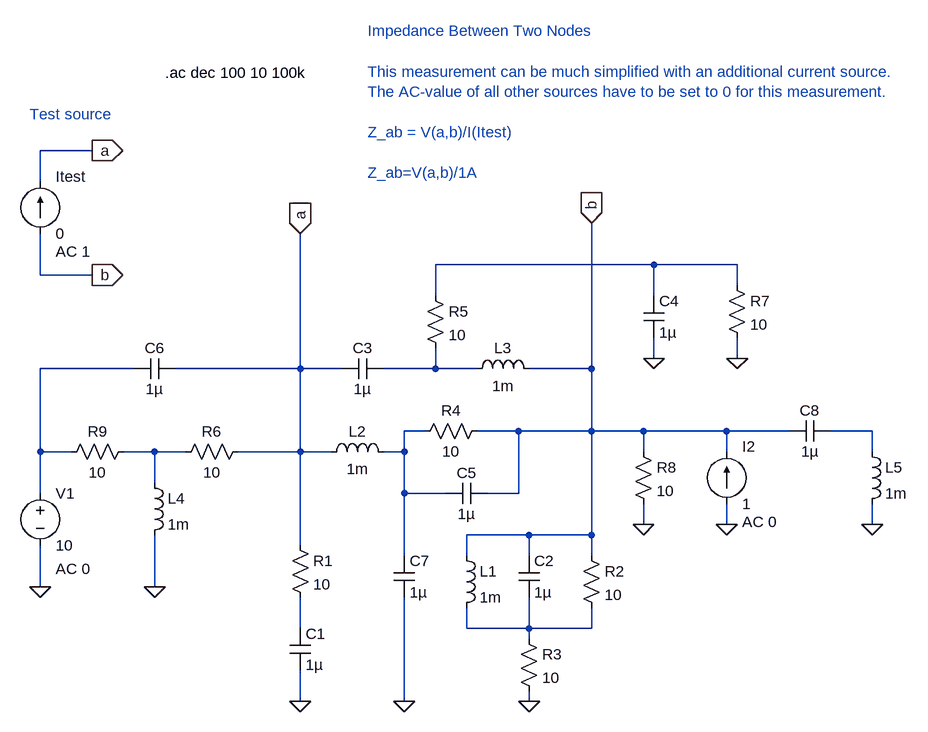
[diagram p0: schematic impedance_measurement1.asc]
impedance_measurement1.asc, the LTspice schematic file:
Version 4
SHEET 1 1068 680
WIRE -272 -384 -352 -384
WIRE -352 -336 -352 -384
WIRE 592 -208 256 -208
WIRE 720 -208 592 -208
WIRE -352 -192 -352 -256
WIRE -272 -192 -352 -192
WIRE 720 -176 720 -208
WIRE 256 -160 256 -208
WIRE 592 -160 592 -208
WIRE 592 -64 592 -96
WIRE 720 -64 720 -96
WIRE -208 -48 -352 -48
WIRE 48 -48 48 -256
WIRE 48 -48 -144 -48
WIRE 112 -48 48 -48
WIRE 256 -48 256 -80
WIRE 256 -48 176 -48
WIRE 320 -48 256 -48
WIRE 496 -48 496 -272
WIRE 496 -48 400 -48
WIRE 240 48 208 48
WIRE 384 48 320 48
WIRE 496 48 496 -48
WIRE 496 48 384 48
WIRE 576 48 496 48
WIRE 704 48 576 48
WIRE 800 48 704 48
WIRE 928 48 864 48
WIRE -352 80 -352 -48
WIRE -304 80 -352 80
WIRE -176 80 -224 80
WIRE -128 80 -176 80
WIRE 48 80 48 -48
WIRE 48 80 -48 80
WIRE 96 80 48 80
WIRE 208 80 208 48
WIRE 208 80 176 80
WIRE 576 80 576 48
WIRE 704 80 704 48
WIRE 928 80 928 48
WIRE -176 128 -176 80
WIRE -352 144 -352 80
WIRE 208 144 208 80
WIRE 272 144 208 144
WIRE 384 144 384 48
WIRE 384 144 336 144
WIRE 576 192 576 160
WIRE 704 192 704 160
WIRE 928 192 928 160
WIRE 400 208 304 208
WIRE 496 208 496 48
WIRE 496 208 400 208
WIRE 48 224 48 80
WIRE 208 240 208 144
WIRE 304 240 304 208
WIRE 400 240 400 208
WIRE 496 240 496 208
WIRE -352 288 -352 224
WIRE -176 288 -176 208
WIRE 48 352 48 304
WIRE 304 352 304 320
WIRE 400 352 400 304
WIRE 400 352 304 352
WIRE 496 352 496 320
WIRE 496 352 400 352
WIRE 400 368 400 352
WIRE 48 464 48 416
WIRE 208 464 208 304
WIRE 400 464 400 448
FLAG 592 -64 0
FLAG 720 -64 0
FLAG 400 464 0
FLAG 48 464 0
FLAG 576 192 0
FLAG -176 288 0
FLAG -352 288 0
FLAG 208 464 0
FLAG 928 192 0
FLAG 48 -256 a
IOPIN 48 -256 In
FLAG 496 -272 b
IOPIN 496 -272 In
FLAG -272 -384 a
IOPIN -272 -384 Out
FLAG -272 -192 b
IOPIN -272 -192 Out
FLAG 704 192 0
SYMBOL res 32 208 R0
SYMATTR InstName R1
SYMATTR Value 10
SYMBOL cap 32 352 R0
SYMATTR InstName C1
SYMATTR Value 1µ
SYMBOL ind 288 224 R0
SYMATTR InstName L1
SYMATTR Value 1m
SYMBOL cap 384 240 R0
SYMATTR InstName C2
SYMATTR Value 1µ
SYMBOL res 480 224 R0
SYMATTR InstName R2
SYMATTR Value 10
SYMBOL res 384 352 R0
SYMATTR InstName R3
SYMATTR Value 10
SYMBOL ind 80 96 R270
WINDOW 0 32 56 VTop 0
WINDOW 3 5 56 VBottom 0
SYMATTR InstName L2
SYMATTR Value 1m
SYMBOL res 224 64 R270
WINDOW 0 32 56 VTop 0
WINDOW 3 0 56 VBottom 0
SYMATTR InstName R4
SYMATTR Value 10
SYMBOL cap 112 -32 R270
WINDOW 0 32 32 VTop 0
WINDOW 3 0 32 VBottom 0
SYMATTR InstName C3
SYMATTR Value 1µ
SYMBOL res 240 -176 R0
SYMATTR InstName R5
SYMATTR Value 10
SYMBOL ind 304 -32 R270
WINDOW 0 32 56 VTop 0
WINDOW 3 5 56 VBottom 0
SYMATTR InstName L3
SYMATTR Value 1m
SYMBOL res -144 96 R270
WINDOW 0 32 56 VTop 0
WINDOW 3 0 56 VBottom 0
SYMATTR InstName R6
SYMATTR Value 10
SYMBOL cap 576 -160 R0
SYMATTR InstName C4
SYMATTR Value 1µ
SYMBOL res 704 -192 R0
SYMATTR InstName R7
SYMATTR Value 10
SYMBOL cap 272 160 R270
WINDOW 0 32 32 VTop 0
WINDOW 3 0 32 VBottom 0
SYMATTR InstName C5
SYMATTR Value 1µ
SYMBOL res 560 64 R0
SYMATTR InstName R8
SYMATTR Value 10
SYMBOL res -320 96 R270
WINDOW 0 32 56 VTop 0
WINDOW 3 0 56 VBottom 0
SYMATTR InstName R9
SYMATTR Value 10
SYMBOL ind -192 112 R0
SYMATTR InstName L4
SYMATTR Value 1m
SYMBOL voltage -352 128 R0
WINDOW 123 24 132 Left 0
WINDOW 39 0 0 Left 0
SYMATTR InstName V1
SYMATTR Value 10
SYMATTR Value2 AC 0
SYMBOL cap -208 -32 R270
WINDOW 0 32 32 VTop 0
WINDOW 3 0 32 VBottom 0
SYMATTR InstName C6
SYMATTR Value 1µ
SYMBOL cap 192 240 R0
SYMATTR InstName C7
SYMATTR Value 1µ
SYMBOL cap 800 64 R270
WINDOW 0 32 32 VTop 0
WINDOW 3 0 32 VBottom 0
SYMATTR InstName C8
SYMATTR Value 1µ
SYMBOL ind 912 64 R0
SYMATTR InstName L5
SYMATTR Value 1m
SYMBOL current 704 160 M180
WINDOW 0 24 88 Left 0
WINDOW 3 24 0 Left 0
WINDOW 123 24 -28 Left 0
WINDOW 39 0 0 Left 0
SYMATTR InstName I2
SYMATTR Value 1
SYMATTR Value2 AC 0
SYMBOL current -352 -256 M180
WINDOW 0 24 88 Left 0
WINDOW 3 24 0 Left 0
WINDOW 123 24 -28 Left 0
WINDOW 39 0 0 Left 0
SYMATTR InstName Itest
SYMATTR Value 0
SYMATTR Value2 AC 1
TEXT 152 -568 Left 0 ;Impedance Between Two Nodes\n \nThis measurement can be much simplified with an additional current source.\nThe AC-value of all other sources have to be set to 0 for this measurement.\n \nZ_ab = V(a,b)/I(Itest)\n  \nZ_ab=V(a,b)/1A
TEXT -160 -504 Left 0 !.ac dec 100 10 100k
TEXT -368 -440 Left 0 ;Test source

The netlist it stands for:
* impedance_measurement1.asc
R1 a N007 10
C1 N007 0 1µ
L1 b N008 1m
C2 b N008 1µ
R2 b N008 10
R3 N008 0 10
L2 a N004 1m
R4 N004 b 10
C3 a N003 1µ
R5 N001 N003 10
L3 N003 b 1m
R6 N006 a 10
C4 N001 0 1µ
R7 N001 0 10
C5 N004 b 1µ
R8 b 0 10
R9 N002 N006 10
L4 N006 0 1m
V1 N002 0 10 AC 0
C6 N002 a 1µ
C7 N004 0 1µ
C8 b N005 1µ
L5 N005 0 1m
I2 0 b 1 AC 0
Itest b a 0 AC 1
* Impedance Between Two Nodes
* This measurement can be much simplified with an additional current source.
* The AC-value of all other sources have to be set to 0 for this measurement.
* Z_ab = V(a,b)/I(Itest)
* Z_ab=V(a,b)/1A
.ac dec 100 10 100k
* Test source
.backanno
.end